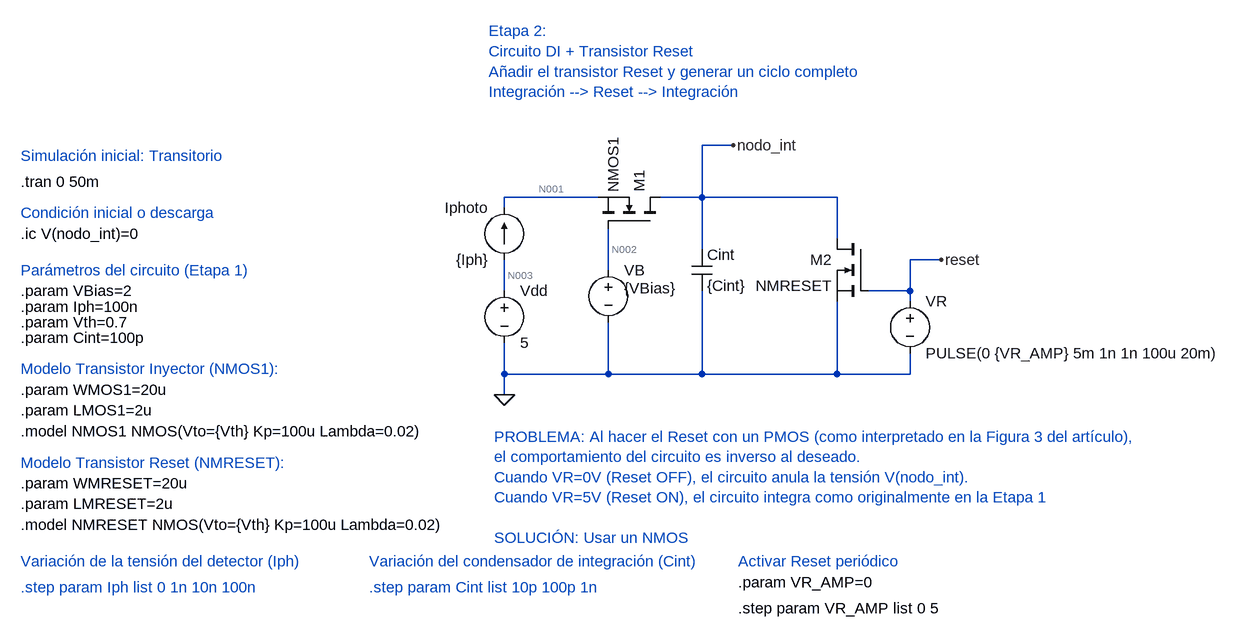
[diagram p0: schematic ID_Etapa2_Reset_NMOS.asc]
ID_Etapa2_Reset_NMOS.asc, the LTspice schematic file:
Version 4.1
SHEET 1 1592 800
WIRE -80 -16 -128 -16
WIRE -288 64 -432 64
WIRE -128 64 -128 -16
WIRE -128 64 -192 64
WIRE 80 64 -128 64
WIRE -432 80 -432 64
WIRE 80 128 80 64
WIRE -128 144 -128 64
WIRE 240 160 192 160
WIRE -272 176 -272 112
WIRE -432 208 -432 160
WIRE 192 208 192 160
WIRE 192 208 128 208
WIRE 192 224 192 208
WIRE -432 336 -432 288
WIRE -272 336 -272 256
WIRE -272 336 -432 336
WIRE -128 336 -128 208
WIRE -128 336 -272 336
WIRE 80 336 80 224
WIRE 80 336 -128 336
WIRE 192 336 192 304
WIRE 192 336 80 336
WIRE -432 368 -432 336
FLAG -80 -16 nodo_int
FLAG -432 368 0
FLAG 240 160 reset
DATAFLAG -128 -16 ""
SYMBOL current -432 160 R180
WINDOW 0 24 80 Left 2
WINDOW 3 24 0 Left 2
SYMATTR InstName Iphoto
SYMATTR Value {Iph}
SYMBOL nmos -192 112 M270
SYMATTR InstName M1
SYMATTR Value NMOS1
SYMATTR SpiceLine W={WMOS1} L={LMOS1}
SYMBOL cap -144 144 R0
SYMATTR InstName Cint
SYMATTR Value {Cint}
SYMBOL voltage -272 160 R0
WINDOW 3 24 44 Left 2
SYMATTR Value {VBias}
SYMATTR InstName VB
SYMBOL voltage -432 192 R0
WINDOW 123 0 0 Left 0
WINDOW 39 0 0 Left 0
SYMATTR InstName Vdd
SYMATTR Value 5
SYMBOL voltage 192 208 R0
WINDOW 123 0 0 Left 0
WINDOW 39 0 0 Left 0
SYMATTR InstName VR
SYMATTR Value PULSE(0 {VR_AMP} 5m 1n 1n 100u 20m)
SYMBOL nmos 128 128 M0
SYMATTR InstName M2
SYMATTR Value NMRESET
SYMATTR SpiceLine W={WMRESET} L={LMRESET}
TEXT -456 -192 Left 2 ;Etapa 2: \nCircuito DI + Transistor Reset\nAñadir el transistor Reset y generar un ciclo completo \nIntegración --> Reset --> Integración
TEXT -1176 424 Left 2 !.model NMOS1 NMOS(Vto={Vth} Kp=100u Lambda=0.02)
TEXT -1176 360 Left 2 !.param WMOS1=20u\n.param LMOS1=2u
TEXT -1176 328 Left 2 ;Modelo Transistor Inyector (NMOS1):
TEXT -1176 0 Left 2 ;Simulación inicial: Transitorio
TEXT -1176 120 Left 2 !.ic V(nodo_int)=0
TEXT -1176 88 Left 2 ;Condición inicial o descarga
TEXT -1176 208 Left 2 !.param VBias=2
TEXT -1176 232 Left 2 !.param Iph=100n
TEXT -1176 256 Left 2 !.param Vth=0.7
TEXT -1176 176 Left 2 ;Parámetros del circuito (Etapa 1)
TEXT -1176 624 Left 2 ;Variación de la tensión del detector (Iph)
TEXT -1176 664 Left 2 ;.step param Iph list 0 1n 10n 100n
TEXT -1176 280 Left 2 !.param Cint=100p
TEXT -1176 40 Left 2 !.tran 0 50m
TEXT -1176 472 Left 2 ;Modelo Transistor Reset (NMRESET):
TEXT -1176 504 Left 2 !.param WMRESET=20u\n.param LMRESET=2u
TEXT -1176 568 Left 2 !.model NMRESET NMOS(Vto={Vth} Kp=100u Lambda=0.02)
TEXT -448 432 Left 2 ;PROBLEMA: Al hacer el Reset con un PMOS (como interpretado en la Figura 3 del artículo), \nel comportamiento del circuito es inverso al deseado. \nCuando VR=0V (Reset OFF), el circuito anula la tensión V(nodo_int).\nCuando VR=5V (Reset ON), el circuito integra como originalmente en la Etapa 1\n \nSOLUCIÓN: Usar un NMOS
TEXT -640 624 Left 2 ;Variación del condensador de integración (Cint)
TEXT -640 664 Left 2 ;.step param Cint list 10p 100p 1n
TEXT -72 656 Left 2 !.param VR_AMP=0
TEXT -72 696 Left 2 !.step param VR_AMP list 0 5
TEXT -72 624 Left 2 ;Activar Reset periódico

The netlist it stands for:
* ID_Etapa2_Reset_NMOS.asc
Iphoto N003 N001 {Iph}
M1 nodo_int N002 N001 N001 NMOS1 W={WMOS1} L={LMOS1}
Cint nodo_int 0 {Cint}
VB N002 0 {VBias}
Vdd N003 0 5
VR reset 0 PULSE(0 {VR_AMP} 5m 1n 1n 100u 20m)
M2 nodo_int reset 0 0 NMRESET W={WMRESET} L={LMRESET}
.model NMOS NMOS
.model PMOS PMOS
.lib standard.mos
* Etapa 2:
* Circuito DI + Transistor Reset
* Añadir el transistor Reset y generar un ciclo completo
* Integración --> Reset --> Integración
.model NMOS1 NMOS(Vto={Vth} Kp=100u Lambda=0.02)
.param WMOS1=20u
.param LMOS1=2u
* Modelo Transistor Inyector (NMOS1):
* Simulación inicial: Transitorio
.ic V(nodo_int)=0
* Condición inicial o descarga
.param VBias=2
.param Iph=100n
.param Vth=0.7
* Parámetros del circuito (Etapa 1)
* Variación de la tensión del detector (Iph)
* .step param Iph list 0 1n 10n 100n
.param Cint=100p
.tran 0 50m
* Modelo Transistor Reset (NMRESET):
.param WMRESET=20u
.param LMRESET=2u
.model NMRESET NMOS(Vto={Vth} Kp=100u Lambda=0.02)
* PROBLEMA: Al hacer el Reset con un PMOS (como interpretado en la Figura 3 del artículo),
* el comportamiento del circuito es inverso al deseado.
* Cuando VR=0V (Reset OFF), el circuito anula la tensión V(nodo_int).
* Cuando VR=5V (Reset ON), el circuito integra como originalmente en la Etapa 1
* SOLUCIÓN: Usar un NMOS
* Variación del condensador de integración (Cint)
* .step param Cint list 10p 100p 1n
.param VR_AMP=0
.step param VR_AMP list 0 5
* Activar Reset periódico
.backanno
.end

* Results of the author's LTspice run, read from the files saved beside the schematic
* Operating Point (first step), zero values left out:
*   V(n001) = 76.93 µV
*   V(n002) = 2 V
*   V(n003) = 5 V
*   I(Iphoto) = 100 nA
*   I(Vdd) = -100 nA
*   Id(M1) = -100 nA
*   Is(M1) = 100 nA
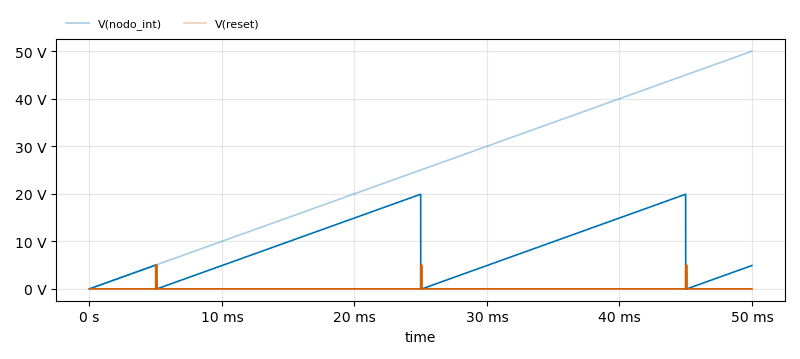
[diagram p1: Transient Analysis of ID_Etapa2_Reset_NMOS.asc, plotted from the saved traces]
* Transient Analysis, 2 runs:
*   V(nodo_int) [vr_amp=0]: min 0 V, max 49.98 V, average 24.99 V, rms 28.86 V, last 49.98 V
*   V(nodo_int) [vr_amp=5]: min 0 V, max 19.9 V, average 8.409 V, rms 10.33 V, last 4.9 V
*   V(reset) [vr_amp=0]: min 0 V, max 0 V, average 0 V, rms 0 V, last 0 V
*   V(reset) [vr_amp=5]: min 0 V, max 5 V, average 30 mV, rms 387.3 mV, last 0 V